# EAGLE design cpuboard (EAGLE 7.2.0)
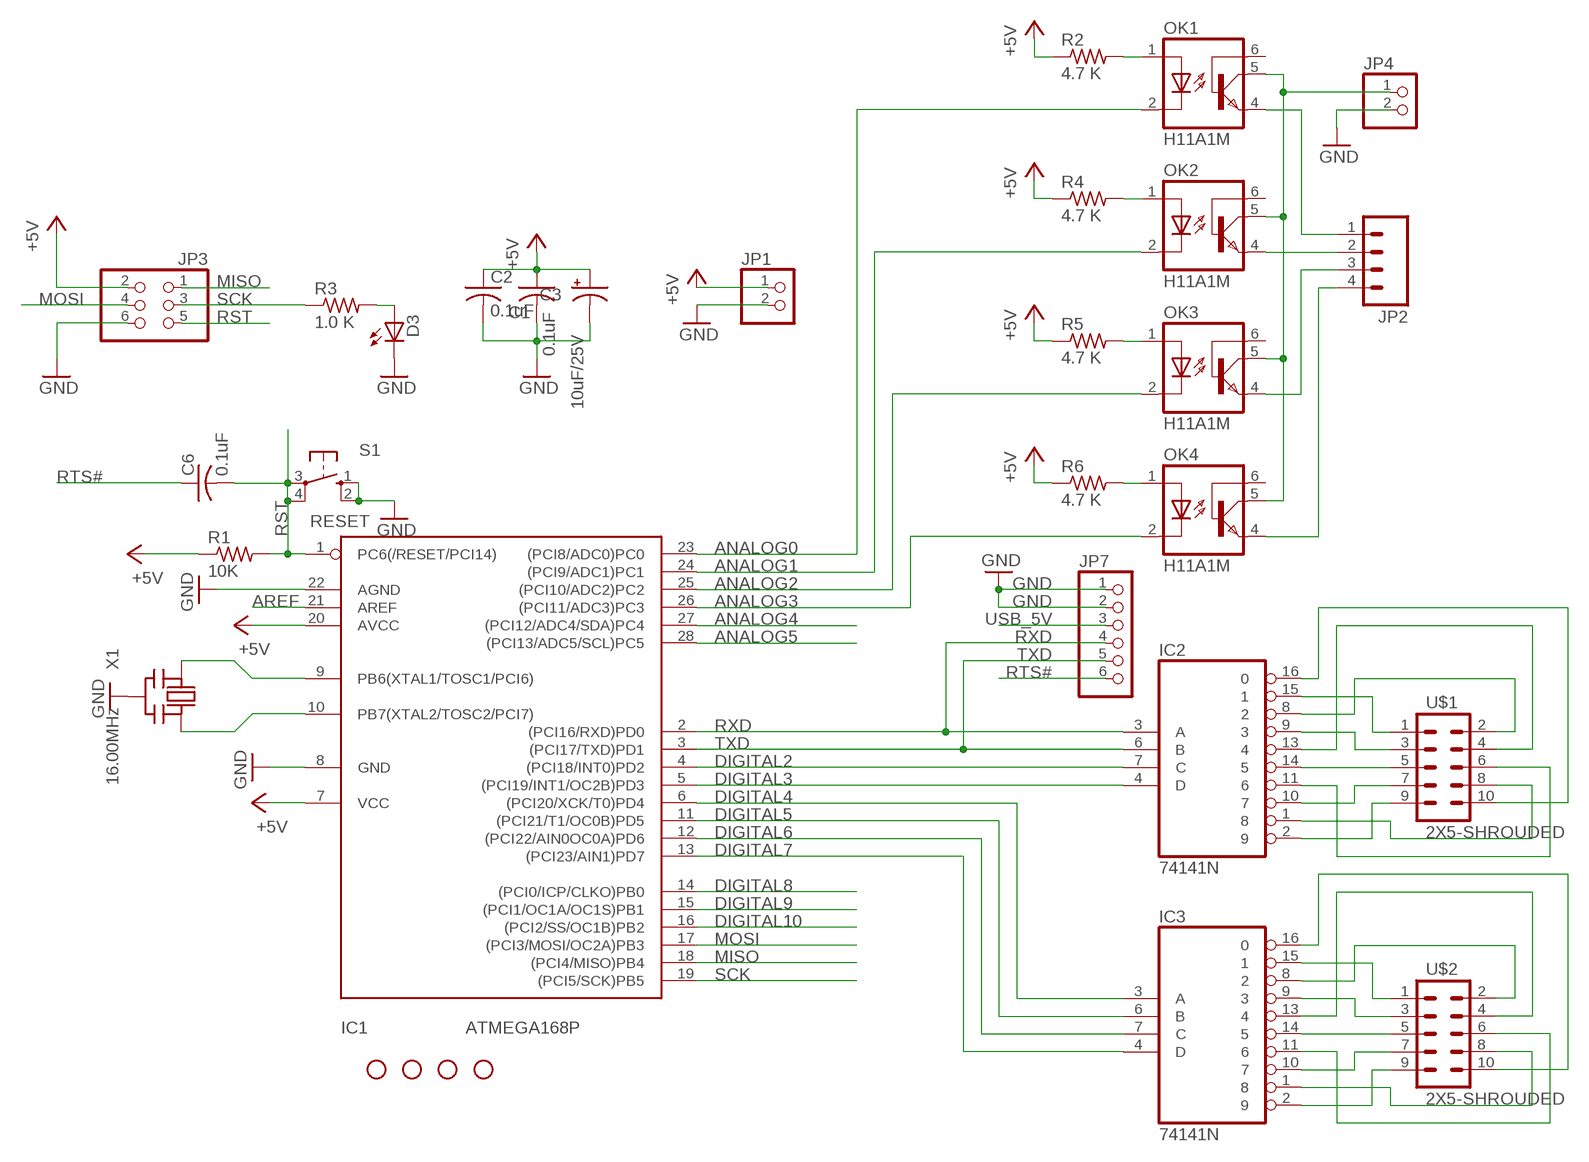
[diagram p0: schematic, sheet 1]

## Parts
C1  0.1uF  C-US025-025X050  [C025-025X050]
C2  0.1uF  C-US025-025X050  [C025-025X050]
C3  10uF/25V  CPOL-USE2.5-6  [E2,5-6]
C6  0.1uF  C-US025-025X050  [C025-025X050]
D3  Green  LED3MM  [LED3MM]
IC1  ATMEGA168P  ATMEGA168PROUND  [DIL28/3]
IC2  74141N  [DIL16]
IC3  74141N  [DIL16]
JP1  PINHD-1X2CB  [1X02-CB]
JP2  M04PTH  [1X04]
JP3  PINHD-2X3  [2X03]
JP4  PINHD-1X2CB  [1X02-CB]
JP7  PINHD-1X6CLEAN  [1X06-CLEAN]
OK1  H11A1M  [DIL06]
OK2  H11A1M  [DIL06]
OK3  H11A1M  [DIL06]
OK4  H11A1M  [DIL06]
R1  10K  R-US_0207/5V  [0207/5V]
R2  4.7 K  R-US_0207/5V  [0207/5V]
R3  1.0 K  R-US_0207/5V  [0207/5V]
R4  4.7 K  R-US_0207/5V  [0207/5V]
R5  4.7 K  R-US_0207/5V  [0207/5V]
R6  4.7 K  R-US_0207/5V  [0207/5V]
S1  RESET  10-XX  [B3F-10XX]
STANDOFF1  STAND-OFF  [STAND-OFF]
STANDOFF2  STAND-OFF  [STAND-OFF]
STANDOFF3  STAND-OFF  [STAND-OFF]
STANDOFF4  STAND-OFF  [STAND-OFF]
U$1  2X5-SHROUDED  [2X5-SHROUDED]
U$2  2X5-SHROUDED  [2X5-SHROUDED]
X1  16.00MHz  CERMOSCILL  [CERM_OSC]

## Nets
+5V: C1.1 C2.1 C3.+ IC1.7(VCC) IC1.20(AVCC) JP1.1 JP3.2 R1.1 R2.1 R4.1 R5.1 R6.1
ANALOG0: IC1.23((PCI8/ADC0)PC0) OK1.2(C)
ANALOG1: IC1.24((PCI9/ADC1)PC1) OK2.2(C)
ANALOG2: IC1.25((PCI10/ADC2)PC2) OK3.2(C)
ANALOG3: IC1.26((PCI11/ADC3)PC3) OK4.2(C)
ANALOG4: IC1.27((PCI12/ADC4/SDA)PC4)
ANALOG5: IC1.28((PCI13/ADC5/SCL)PC5)
AREF: IC1.21(AREF)
DIGITAL2: IC1.4((PCI18/INT0)PD2) IC2.7(C)
DIGITAL3: IC1.5((PCI19/INT1/OC2B)PD3) IC2.4(D)
DIGITAL4: IC1.6((PCI20/XCK/T0)PD4) IC3.3(A)
DIGITAL5: IC1.11((PCI21/T1/OC0B)PD5) IC3.6(B)
DIGITAL6: IC1.12((PCI22/AIN0OC0A)PD6) IC3.7(C)
DIGITAL7: IC1.13((PCI23/AIN1)PD7) IC3.4(D)
DIGITAL8: IC1.14((PCI0/ICP/CLKO)PB0)
DIGITAL9: IC1.15((PCI1/OC1A/OC1S)PB1)
DIGITAL10: IC1.16((PCI2/SS/OC1B)PB2)
GND: C1.2 C2.2 C3.- D3.K(C) IC1.8(GND) IC1.22(AGND) JP1.2 JP3.6 JP4.2 JP7.1 JP7.2 S1.1(S) S1.2(S1) X1.P$2(GND)
MISO: IC1.18((PCI4/MISO)PB4) JP3.1
MOSI: IC1.17((PCI3/MOSI/OC2A)PB3) JP3.4
N$1: IC1.9(PB6(XTAL1/TOSC1/PCI6)) X1.P$1(IN)
N$2: IC1.10(PB7(XTAL2/TOSC2/PCI7)) X1.P$3(OUT)
N$3: IC2.13 U$1.4
N$4: D3.A R3.2
N$5: IC2.15 U$1.1
N$6: IC2.9 U$1.3
N$7: IC2.14 U$1.5
N$8: IC2.10 U$1.7
N$9: IC2.2 U$1.9
N$10: IC2.8 U$1.2
N$11: IC2.1 U$1.8
N$12: IC2.11 U$1.6
N$13: IC2.16 U$1.10
N$14: IC3.15 U$2.1
N$15: IC3.9 U$2.3
N$16: IC3.14 U$2.5
N$17: IC3.10 U$2.7
N$18: IC3.2 U$2.9
N$19: IC3.8 U$2.2
N$20: IC3.1 U$2.8
N$21: IC3.11 U$2.6
N$22: IC3.13 U$2.4
N$23: IC3.16 U$2.10
N$27: OK4.1(A) R6.2
N$28: OK3.1(A) R5.2
N$29: OK2.1(A) R4.2
N$30: OK1.1(A) R2.2
N$31: JP2.1 OK1.4(EMI)
N$32: JP2.2 OK2.4(EMI)
N$33: JP2.3 OK3.4(EMI)
N$34: JP2.4 OK4.4(EMI)
N$35: JP4.1 OK1.5(COL) OK2.5(COL) OK3.5(COL) OK4.5(COL)
RST: C6.2 IC1.1(PC6(/RESET/PCI14)) JP3.5 R1.2 S1.3(P) S1.4(P1)
RTS#: C6.1 JP7.6
RXD: IC1.2((PCI16/RXD)PD0) IC2.3(A) JP7.4
SCK: IC1.19((PCI5/SCK)PB5) JP3.3 R3.1
TXD: IC1.3((PCI17/TXD)PD1) IC2.6(B) JP7.5
USB_5V: JP7.3
Unconnected: OK1.6(BAS) OK2.6(BAS) OK3.6(BAS) OK4.6(BAS)

## Power pins joined to a net without a drawn wire
GND: IC2.12(GND) IC3.12(GND)
VCC: IC2.5(VCC) IC3.5(VCC)

## Library data of the parts
C1 C2 C6 = minimidi:C-US: CAPACITOR, American symbol
C3 = minimidi:CPOL-US: POLARIZED CAPACITOR, American symbol
D3 = minimidi:LED: LED OSRAM: - CHIPLED LG R971, LG N971, LY N971, LG Q971, LY Q971, LO R971, LY R971 LH N974, LH R974 LS Q976, LO Q976, LY Q976 LO Q996 - Hyper CHIPLED LW Q18S LB Q993, LB Q99A, LB R99A - SideLED LS A670, LO A670, LY A670, LG A670, LP A670 LB A673, LV A673, LT A673, LW A673 LH A674 LY A675 LS A676, LA A676, LO A676, LY A676, LW A676 LS A679, LY A679, LG A679 - Hyper Micro SIDELED® LS Y876, LA Y876, LO Y876, LY Y876 LT Y87S - SmartLED LW L88C, LW L88S LB L89C, LB L89S, LG L890 LS L89K, LO L89K, LY L89K LS L896, LA L896, LO L896, LY L896 - TOPLED LS T670, LO T670, LY T670, LG T670, LP T670 LSG T670, LSP T670, LSY T670, LOP T670, LYG T670 LG T671, LOG T671, LSG T671 LB T673, LV T673, LT T673, LW T673 LH T674 LS T676, LA T676, LO T676, LY T676, LB T676, LH T676, LSB T676, LW T676 LB T67C, LV T67C, LT T67C, LS T67K, LO T67K, LY T67K, LW E67C LS E67B, LA E67B, LO E67B, LY E67B, LB E67C, LV E67C, LT E67C LW T67C LS T679, LY T679, LG T679 LS T770, LO T770, LY T770, LG T770, LP T770 LB T773, LV T773, LT T773, LW T773 LH T774 LS E675, LA E675, LY E675, LS T675 LS T776, LA T776, LO T776, LY T776, LB T776 LHGB T686 LT T68C, LB T68C - Hyper Mini TOPLED® LB M676 - Mini TOPLED Santana® LG M470 LS M47K, LO M47K, LY M47K Source: http://www.osram.convergy.de/
IC1 = avr:ATMEGA168*P: MICROCONTROLLER 16 kBytes FLASH 1 kBytes SRAM 512 Bytes EEPROM USART 8-channel 10 bit ADC
IC2 IC3 = 74xx-us:74*141: BCD to decimal DECODER/DRIVER
JP1 JP4 = carduino:PINHD-1X2: PIN HEADER
JP2 = SparkFun-Connectors:M04: Header 4 Standard 4-pin 0.1" header. Use with straight break away headers (SKU : PRT-00116), right angle break away headers (PRT-00553), swiss pins (PRT-00743), machine pins (PRT-00117), and female headers (PRT-00115). Molex polarized connector foot print use with SKU : PRT-08231 with associated crimp pins and housings. 1MM SMD Version SKU: PRT-10208
JP3 = pinhead-ez:PINHD-2X3: PIN HEADER
JP7 = carduino:PINHD-1X6: PIN HEADER
OK1-OK4 = bodger:H11A*?M: General Purpose 6-Pin Phototransistor Optocouplers Source: http://www.fairchildsemi.com/ds/4N/4N35-M.pdf; MPN: H11A1-M; OC_FARNELL: 1021358; OC_NEWARK: 97K1793
R1 = rcl-ez:R-US_: RESISTOR, American symbol
R2-R6 = minimidi:R-US_: RESISTOR, American symbol
S1 = switch-omron:10-XX: OMRON SWITCH
STANDOFF1-STANDOFF4 = SparkFun-Electromechanical:STAND-OFF: #4 Stand Off This is the mechanical footprint for a #4 phillips button head screw. Use the keepout ring to avoid running the screw head into surrounding components. SKU : PRT-00447
U$1 U$2 = bodger:2X5-SHROUDED
X1 = digg:CERMOSCILL

## Board
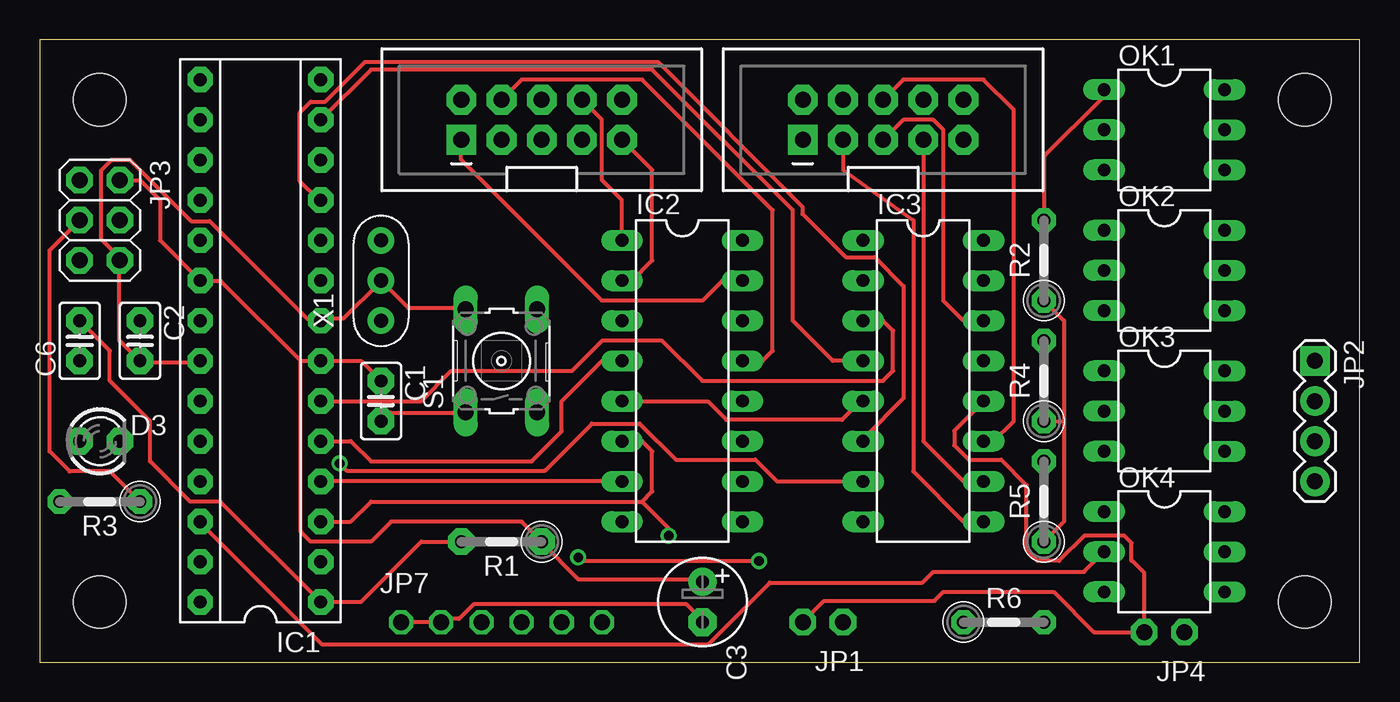
[diagram p1: board, top side]
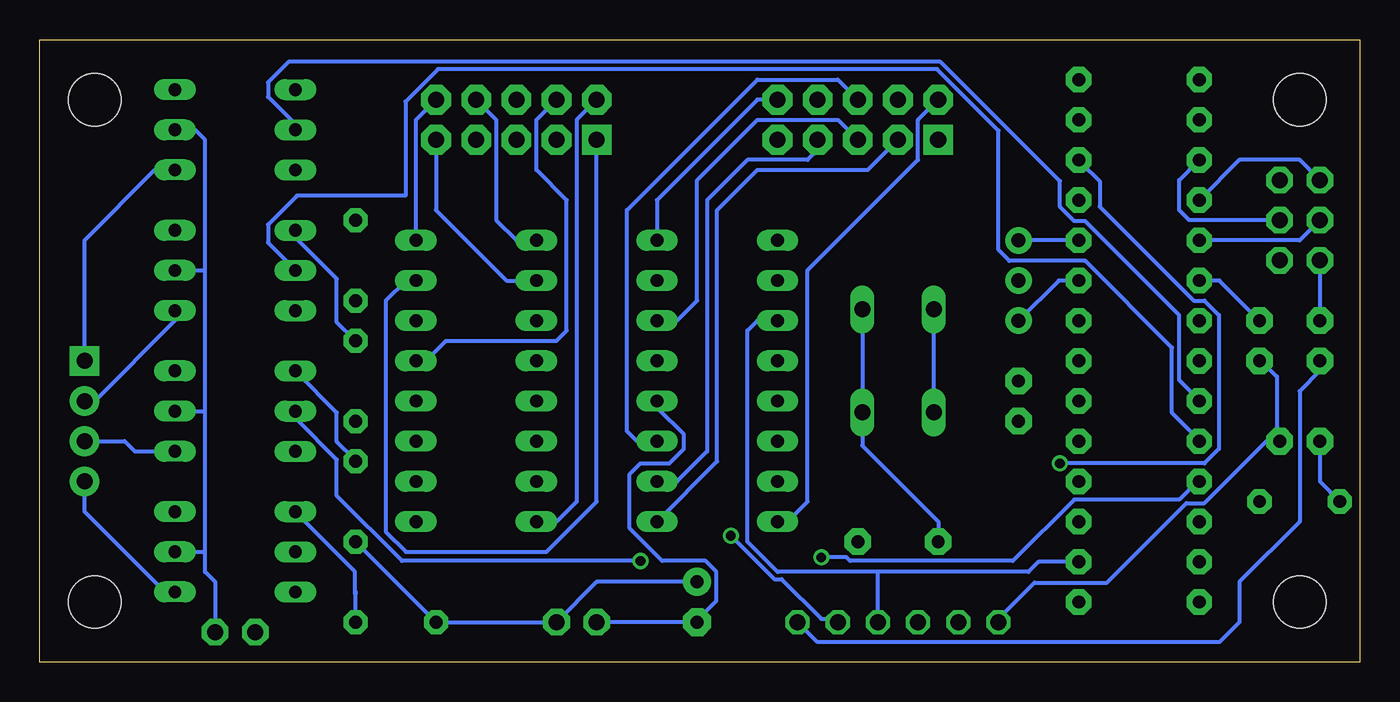
[diagram p2: board, bottom side, seen from below]

Size 83.49 x 39.36 mm. Coordinates in mm from the lower left corner, seen from the top.
Outline: 0,0 83.49,0 83.49,39.36 0,39.36 0,0
Copper layers (1*16): Top 0.035mm / dielectric 1.5mm / Bottom 0.035mm
Design rules "default": minimum track width 10mil, minimum drill 24mil, track to track 8mil, track to pad 8mil, pad to pad 8mil, via to via 8mil, smd to smd 8mil, copper to edge 40mil, drill to drill 8mil, minimum pad ring 10mil, minimum via ring 8mil, stop-mask expansion 4mil, vias tented up to drill 0mil, thermal gap 10mil

### Footprints (pad centres in the part's own frame; a part is rotated, then mirrored left to right if it is on the bottom)
C025-025X050 = drill 0.813 pad 1.676 octagon: 1 -1.27,0; 2 1.27,0
E2,5-6 = drill 0.813 pad 1.778: + -1.27,0 | drill 0.813 pad 1.778 octagon: - 1.27,0
LED3MM = drill 0.813 pad 1.676 octagon: A -1.27,0; K 1.27,0
DIL28/3 = drill 0.813 pad 1.6 octagon: 1 -16.51,-3.81; 2 -13.97,-3.81; 3 -11.43,-3.81; 4 -8.89,-3.81; 5 -6.35,-3.81; 6 -3.81,-3.81; 7 -1.27,-3.81; 8 1.27,-3.81; 9 3.81,-3.81; 10 6.35,-3.81; 11 8.89,-3.81; 12 11.43,-3.81; 13 13.97,-3.81; 14 16.51,-3.81; 15 16.51,3.81; 16 13.97,3.81; 17 11.43,3.81; 18 8.89,3.81; 19 6.35,3.81; 20 3.81,3.81; 21 1.27,3.81; 22 -1.27,3.81; 23 -3.81,3.81; 24 -6.35,3.81; 25 -8.89,3.81; 26 -11.43,3.81; 27 -13.97,3.81; 28 -16.51,3.81
DIL16 = drill 0.813 long: 1 -8.89,-3.81; 2 -6.35,-3.81; 3 -3.81,-3.81; 4 -1.27,-3.81; 5 1.27,-3.81; 6 3.81,-3.81; 7 6.35,-3.81; 8 8.89,-3.81; 9 8.89,3.81; 10 6.35,3.81; 11 3.81,3.81; 12 1.27,3.81; 13 -1.27,3.81; 14 -3.81,3.81; 15 -6.35,3.81; 16 -8.89,3.81
1X02-CB = drill 1.016 pad 1.676 octagon: 1 -1.27,0; 2 1.27,0
1X04 = drill 1.016 pad 1.88 square: 1 0,0 | drill 1.016 pad 1.88: 2 2.54,0; 3 5.08,0; 4 7.62,0
2X03 = drill 1.016 pad 1.676 octagon: 1 -2.54,-1.27; 2 -2.54,1.27; 3 0,-1.27; 4 0,1.27; 5 2.54,-1.27; 6 2.54,1.27
1X06-CLEAN = drill 1.016 octagon: 1 -6.35,0; 2 -3.81,0; 3 -1.27,0; 4 1.27,0; 5 3.81,0; 6 6.35,0
DIL06 = drill 0.813 long: 1 -2.54,-3.81; 2 0,-3.81; 3 2.54,-3.81; 4 2.54,3.81; 5 0,3.81; 6 -2.54,3.81
0207/5V = drill 0.813 pad 1.676 octagon: 1 -2.54,0; 2 2.54,0
0207/5V' = drill 0.813 pad 1.524 octagon: 1 -2.54,0; 2 2.54,0
B3F-10XX = drill 1.016 long: 1 -3.251,2.261; 2 3.251,2.261; 3 -3.251,-2.261; 4 3.251,-2.261
STAND-OFF = hole 3.302: 0,0
2X5-SHROUDED = drill 1.016 pad 1.88 square: 1 -1.27,5.08 | drill 1.016 pad 1.88 octagon: 2 1.27,5.08; 3 -1.27,2.54; 4 1.27,2.54; 5 -1.27,0; 6 1.27,0; 7 -1.27,-2.54; 8 1.27,-2.54; 9 -1.27,-5.08; 10 1.27,-5.08
CERM_OSC = drill 0.9 pad 1.676: P$1 -2.54,0; P$2 0,0; P$3 2.54,0

### Placement (x,y rotation side)
C1  21.59,16.51 270 top
C2  6.35,20.32 270 top
C3  41.91,3.81 270 top
C6  2.54,20.32 90 top
D3  3.81,13.97 0 top
IC1  13.97,20.32 90 top
IC2  40.64,17.78 270 top
IC3  55.88,17.78 270 top
JP1  49.53,2.54 180 top
JP2  80.64,19.05 270 top
JP3  3.81,27.94 270 top
JP4  71.12,1.91 180 top
JP7  29.21,2.54 0 top
OK1  71.12,33.66 270 top
OK2  71.12,24.77 270 top
OK3  71.12,15.88 270 top
OK4  71.12,6.99 270 top
R1  29.21,7.62 180 top
R2  4.7 K  [0207/5V']  63.5,25.4 90 top
R3  1.0 K  [0207/5V']  3.81,10.16 180 top
R4  4.7 K  [0207/5V']  63.5,17.78 90 top
R5  4.7 K  [0207/5V']  63.5,10.16 90 top
R6  4.7 K  [0207/5V']  60.96,2.54 0 top
S1  29.21,19.05 90 top
STANDOFF1  3.81,3.81 0 top
STANDOFF2  3.81,35.56 0 top
STANDOFF3  80.01,35.56 0 top
STANDOFF4  80.01,3.81 0 top
U$1  31.75,34.29 90 top
U$2  53.34,34.29 90 top
X1  21.59,24.13 90 top

### Tracks (layer width: path | path; a pad name or v marks a point on that pad's centre or on a via)
+5V
  Top 0.254: R2.1 64.77,21.59 64.77,15.24 | 64.77,15.24 64.77,8.89 R5.1 | R4.1 64.77,15.24 | JP3.2 6.35,30.48 7.62,29.21 7.62,26.67 IC1.20 11.43,24.13 16.51,19.05 | 16.51,19.05 IC1.7 20.32,19.05 C1.1 | 16.51,19.05 16.51,8.26 17.14,7.62 20.95,7.62 22.23,8.89 30.48,8.89 R1.1 31.77,7.54 34.06,5.26 41.83,5.26 C3.+
  Bottom 0.254: R5.1 R6.1 JP1.1 48.26,5.08 C3.+ | C2.1 8.89,24.13 IC1.20
ANALOG0
  Bottom 0.254: OK1.2 67.44,33.68 67.44,34.14 69.04,35.74 69.04,36.65 67.74,37.95 26.52,37.95 18.97,30.4 18.97,28.8 18.06,27.89 17.37,27.89 11.43,21.95 11.43,17.83 10.29,16.69 IC1.23
ANALOG1
  Bottom 0.254: IC1.24 10.29,14.17 11.89,15.77 11.89,19.89 17.37,25.38 22.17,25.38 22.86,26.06 22.86,33.6 26.75,37.49 58.29,37.49 60.35,35.43 60.35,29.49 67.21,29.49 69.04,27.66 69.04,26.52 67.44,24.92 OK2.2
ANALOG2  (via drill 0.61)
  Top 0.254: v45.49,6.4 34.29,6.4 v34.06,6.63
  Bottom 0.254: v34.06,6.63 32.46,6.63 32.23,6.4 21.95,6.4 18.06,10.29 11.43,10.29 10.29,11.43 IC1.25 | v45.49,6.4 60.58,6.4 64.69,10.52 64.69,12.8 67.21,15.32 67.21,15.77 OK3.2
ANALOG3
  Top 0.254: 67.21,6.93 OK4.2 66.04,5.71 56.52,5.71 55.83,5.03 46.18,5.03 42.29,1.14 17.83,1.14 10.29,8.69 IC1.26
DIGITAL2
  Top 0.254: IC2.7 IC1.4
DIGITAL3
  Top 0.254: IC1.5 19.68,13.97 20.95,12.7 31.11,12.7 33.02,14.61 33.02,16.51 35.56,19.05 IC2.4
DIGITAL4
  Top 0.254: IC1.6 24.13,16.51 26.04,18.41 33.66,18.41 35.56,20.32 39.37,20.32 41.91,17.78 53.34,17.78 53.98,18.41 53.98,20.95 53.34,21.59 IC3.3
DIGITAL5
  Top 0.254: IC3.6 52.12,14.17 54.63,16.69 54.63,23.77 52.81,25.6 50.98,25.6 48.23,28.35 48.23,28.8 39.09,37.95 20.57,37.95 18.06,35.43 17.14,35.43 16.46,34.75 16.46,30.4 17.6,29.26 IC1.11
DIGITAL6  (via drill 0.61)
  Top 0.254: IC3.7 46.63,11.43 45.26,12.8 40.23,12.8 37.95,15.09 34.92,15.09 31.95,12.12 19.43,12.12 v18.97,12.57
  Bottom 0.254: v18.97,12.57 9.83,12.57 8.91,13.49 8.91,21.95 9.83,22.86 10.52,22.86 16.46,28.8 16.46,30.4 17.6,31.55 IC1.12
DIGITAL7
  Top 0.254: IC3.4 50.16,19.05 47.62,21.59 47.62,28.57 38.73,37.47 20.95,37.47 IC1.13
GND
  Top 0.254: IC3.12 59.66,16.46 57.84,14.63 57.84,13.72 58.75,12.8 60.81,12.8 62.41,11.2 62.41,7.09 63.09,6.4 64.47,6.4 66.06,8 68.58,8 69.04,7.54 69.04,6.4 69.08,6.44 | S1.1 26.75,15.77 22.17,15.77 21.72,15.32 C1.2 | S1.2 26.75,22.4 23.32,22.4 X1.P$2 21.49,24 19.2,21.72 17.83,21.72 IC1.8 17.6,21.72 16.92,21.72 10.74,27.89 9.6,27.89 5.71,31.77 4.57,31.77 3.89,31.09 3.89,26.75 5.03,25.6 JP3.6 5.03,25.38 5.03,20.34 6.17,19.2 C2.2 6.4,18.97 10.06,18.97 IC1.22 | JP7.1 22.86,2.52 25.38,2.52 JP7.2 25.6,2.74 26.52,2.74 27.43,3.66 40.92,3.66 41.83,2.74 C3.- | JP1.2 49.61,3.89 56.59,3.89 57.15,4.45 64.14,4.45 66.67,1.91 JP4.2 69.85,5.66 69.08,6.44 | 69.08,6.44 69.04,6.48
  Bottom 0.254: S1.1 26.98,16 26.98,22.17 S1.2 | C2.2 6.17,18.97 5.26,18.06 5.26,14.17 D3.K 5.26,13.95 5.94,13.95 9.83,10.06 10.97,10.06 16,5.03 20.57,5.03 22.86,2.74 JP7.1 | IC2.12 44.35,16.46 44.35,16 42.75,14.4 42.75,13.49 43.66,12.57 45.49,12.57 46.18,11.89 46.18,8.46 44.12,6.4 41.38,6.4 40.69,5.71 40.69,3.89 41.83,2.74 C3.- 42.06,2.52 48.23,2.52 JP1.2
MISO
  Bottom 0.254: JP3.1 3.81,31.75 7.62,31.75 IC1.18
MOSI
  Bottom 0.254: JP3.4 10.79,27.94 11.43,28.57 11.43,30.48 IC1.17
N$1
  Bottom 0.254: IC1.9 19.05,24.13 X1.P$1
N$2
  Bottom 0.254: IC1.10 X1.P$3
N$3
  Top 0.254: IC2.13 45.72,19.05 46.35,19.68 46.35,28.57 38.1,36.83 30.48,36.83 U$1.4
N$4
  Bottom 0.254: D3.A 2.54,11.43 R3.2
N$5
  Top 0.254: IC2.15 43.18,24.13 41.91,22.86 35.56,22.86 26.67,31.75 U$1.1
N$6
  Bottom 0.254: IC2.9 40.64,12.7 40.64,28.57 38.1,31.11 31.11,31.11 U$1.3
N$7
  Bottom 0.254: IC2.14 43.18,21.59 41.91,22.86 41.91,30.48 38.1,34.29 33.02,34.29 U$1.5
N$8
  Bottom 0.254: U$1.7 34.29,32.38 34.92,31.75 38.73,31.75 41.27,29.21 41.27,13.34 43.18,11.43 IC2.10
N$9
  Top 0.254: IC2.2 37.47,24.13 38.73,25.4 38.73,31.11 U$1.9
N$10
  Bottom 0.254: IC2.8 36.2,8.89 34.92,10.16 34.92,24.77 27.94,31.75 27.94,34.29 U$1.2
N$11
  Top 0.254: IC2.1 36.83,29.21 35.56,30.48 35.56,34.29 U$1.8
N$12
  Bottom 0.254: IC2.11 45.72,13.97 46.35,14.61 46.35,28.57 38.1,36.83 33.02,36.83 U$1.6
N$13
  Bottom 0.254: U$1.10 38.1,35.56 44.45,29.21 IC2.16
N$14
  Bottom 0.254: IC3.15 60.33,24.13 61.59,22.86 61.59,8.26 60.33,6.99 51.44,6.99 48.26,10.16 U$2.1
N$15
  Top 0.254: U$2.3 50.8,31.11 55.24,27.94 55.24,12.06 58.42,8.89 IC3.9
N$16
  Top 0.254: IC3.14 58.42,21.59 57.15,22.86 57.15,33.66 56.52,34.29 54.61,34.29 U$2.5
N$17
  Top 0.254: U$2.7 55.88,13.97 58.42,11.43 IC3.10
N$18
  Bottom 0.254: U$2.9 58.42,28.57 53.98,24.13 IC3.2
N$19
  Bottom 0.254: U$2.2 49.53,34.29 49.53,10.16 50.8,8.89 IC3.8
N$20
  Bottom 0.254: U$2.8 54.61,34.29 54.61,27.94 53.34,26.67 IC3.1
N$21
  Top 0.254: IC3.11 60.33,13.97 61.59,15.24 61.59,34.92 59.69,36.83 54.61,36.83 U$2.6
N$22
  Bottom 0.254: IC3.13 59.05,19.05 57.78,20.32 50.8,20.32 50.16,20.95 50.16,29.21 52.07,31.11 52.07,34.29 U$2.4
N$23
  Bottom 0.254: IC3.16 59.69,34.29 U$2.10
N$27
  Bottom 0.254: R6.2 63.5,4.34 | 63.5,4.34 63.5,4.45 | 66.67,9.53 OK4.1 67.21,9.37 63.55,5.71 63.55,4.34 63.5,4.34
N$28
  Bottom 0.254: OK3.1 67.21,18.29 64.69,15.77 64.69,13.95 63.55,12.8 R5.2
N$29
  Bottom 0.254: OK2.1 67.21,27.2 67.21,26.75 64.69,24.23 64.69,21.49 63.55,20.34 R4.2
N$30
  Top 0.254: OK1.1 67.21,36.12 67.21,35.66 63.55,32 63.55,28.12 R2.2
N$31
  Bottom 0.254: JP2.1 80.64,26.67 76.2,31.11 OK1.4
N$32
  Bottom 0.254: JP2.2 80.01,16.51 74.93,21.59 OK2.4
N$33
  Bottom 0.254: JP2.3 78.11,13.97 77.47,13.34 OK3.4
N$34
  Bottom 0.254: OK4.4 75.56,4.45 80.64,9.53 JP2.4
N$35
  Bottom 0.254: 73.03,6.99 73.03,5.71 72.39,5.08 JP4.1 | 73.03,6.99 73.03,15.88 | 73.03,15.88 73.03,24.77 | OK2.5 73.03,24.77 | OK3.5 73.03,15.88 | 73.03,24.77 73.03,33.02 73.66,33.66 OK1.5 | OK4.5 73.03,6.99
RST
  Top 0.254: R1.2 24.13,7.62 20.32,3.81 IC1.1 11.43,10.16 9.53,10.16 6.99,12.7 6.99,15.24 4.45,17.78 4.45,19.68 C6.2
  Bottom 0.254: JP3.5 C6.2 | S1.4 S1.3 31.47,13.69 26.67,8.89 R1.2
RTS#
  Bottom 0.254: C6.1 2.54,18.41 3.81,17.14 3.81,8.89 7.62,5.08 7.62,2.54 8.89,1.27 34.29,1.27 JP7.6
RXD
  Bottom 0.254: IC1.2 20.32,6.35 20.95,5.71 30.48,5.71 | 30.48,5.71 36.83,5.71 38.73,7.62 38.73,20.95 38.1,21.59 IC2.3 | JP7.4 30.48,5.71
SCK
  Top 0.254: R3.1 4.45,12.06 1.91,12.06 0.64,13.34 0.64,26.04 JP3.3
  Bottom 0.254: JP3.3 3.81,26.67 IC1.19
TXD  (via drill 0.61)
  Top 0.254: IC1.3 19.68,8.89 20.95,10.16 38.1,10.16 | 38.1,10.16 38.73,10.79 38.73,13.34 38.1,13.97 IC2.6 | v39.78,8 39.78,8.46 38.18,10.06 38.1,10.16
  Bottom 0.254: v39.78,8 37.03,5.26 36.58,5.26 34.06,2.74 33.15,2.74 JP7.5
VCC
  Top 0.254: IC2.5 37.03,16.46 42.29,16.46 43.43,15.32 50.75,15.32 51.89,16.46 IC3.5